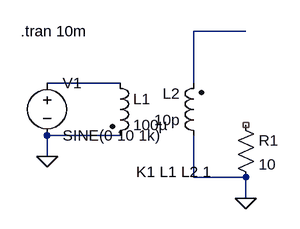
[diagram p0: schematic inductive-coupling.asc]
inductive-coupling.asc, the LTspice schematic file:
Version 4
SHEET 1 880 680
WIRE 320 32 240 32
WIRE 128 112 16 112
WIRE 240 112 240 32
WIRE 128 192 16 192
WIRE 16 224 16 192
WIRE 240 256 240 192
WIRE 320 256 240 256
WIRE 320 288 320 256
FLAG 16 224 0
FLAG 320 288 0
SYMBOL ind2 112 96 R0
SYMATTR InstName L1
SYMATTR Value 100µ
SYMATTR Type ind
SYMATTR SpiceLine Rser=10u Rpar=100
SYMBOL ind2 256 208 R180
WINDOW 0 36 80 Left 2
WINDOW 3 36 40 Left 2
SYMATTR InstName L2
SYMATTR Value 10p
SYMATTR Type ind
SYMATTR SpiceLine Rser=10u Rpar=100
SYMBOL voltage 16 96 R0
WINDOW 123 0 0 Left 2
WINDOW 39 0 0 Left 2
SYMATTR InstName V1
SYMATTR Value SINE(0 10 1k)
SYMBOL res 304 160 R0
SYMATTR InstName R1
SYMATTR Value 10
TEXT 152 248 Left 2 !K1 L1 L2 1
TEXT -24 32 Left 2 !.tran 10m

The netlist it stands for:
* inductive-coupling.asc
L1 N002 0 100µ Rser=10u Rpar=100
L2 0 N001 10p Rser=10u Rpar=100
V1 N002 0 SINE(0 10 1k)
R1 NC_01 0 10
K1 L1 L2 1
.tran 10m
.backanno
.end